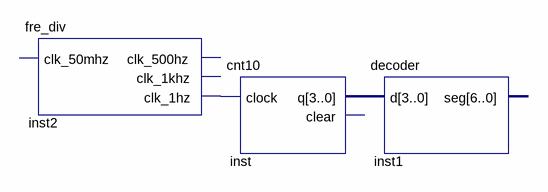
[diagram p0: schematic sheet]
// Quartus schematic 7seg_display_cnt10.bdf as structural Verilog: 3 symbols, 0 pins
module \7seg_display_cnt10  (
);

  wire inst2_clk_1hz;
  wire [3:0] inst_q;

  fre_div inst2 (.clk_1hz(inst2_clk_1hz));  // open: clk_50mhz, clk_500hz, clk_1khz
  cnt10 inst (.clock(inst2_clk_1hz), .q(inst_q));  // open: clear
  decoder inst1 (.d(inst_q));  // open: seg
endmodule
